# EAGLE design HC-05or06-Breakout (EAGLE 6.2)
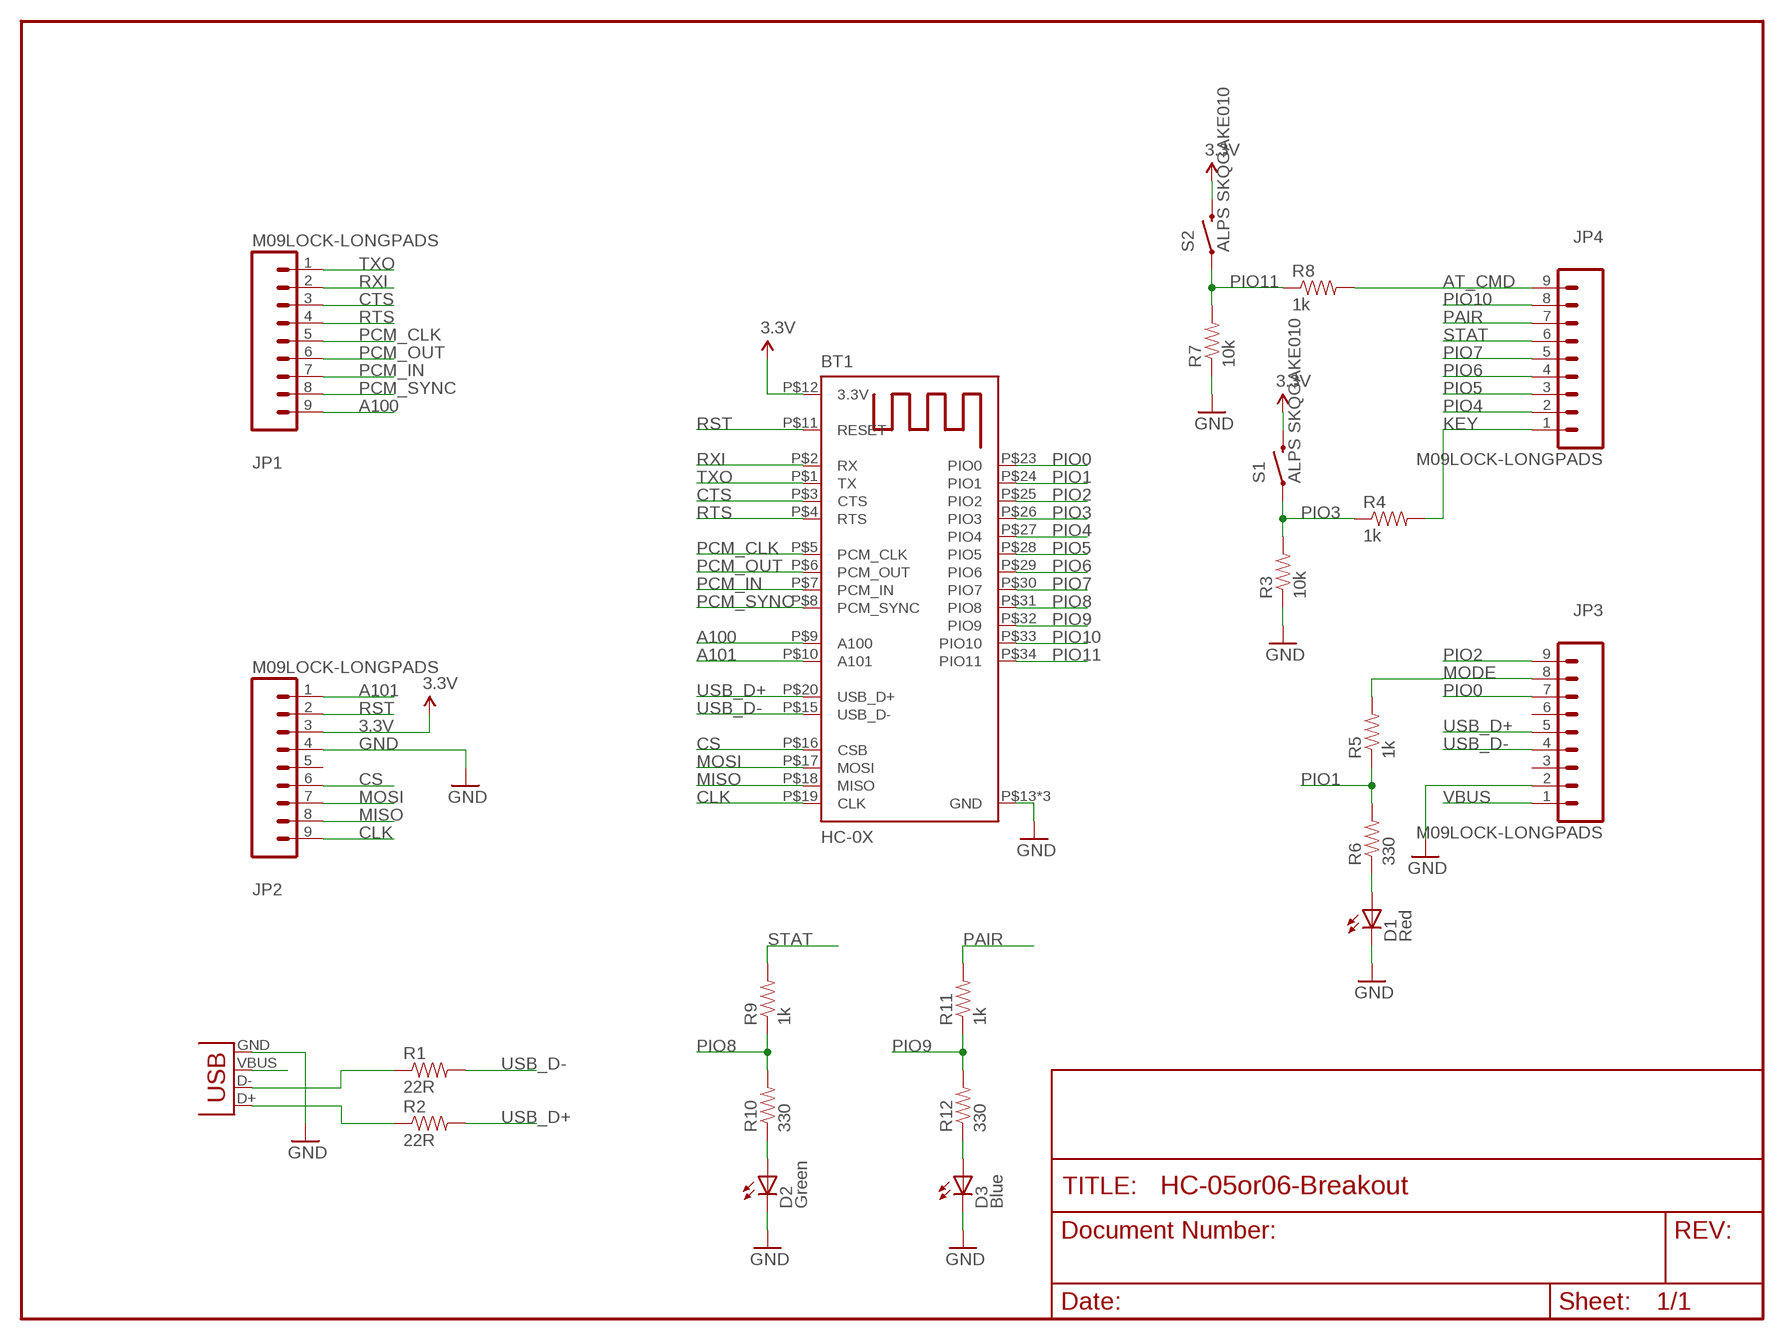
[diagram p0: schematic, sheet 1]

## Parts
BT1  HC-0X  [HC-0X]
D1  Red  LED0603  [LED-0603]
D2  Green  LED0603  [LED-0603]
D3  Blue  LED0603  [LED-0603]
JP1  M09LOCK-LONGPADS  [1X09_LOCK_LONGPADS]
JP2  M09LOCK-LONGPADS  [1X09_LOCK_LONGPADS]
JP3  M09LOCK-LONGPADS  [1X09_LOCK_LONGPADS]
JP4  M09LOCK-LONGPADS  [1X09_LOCK_LONGPADS]
R1  22R  RESISTOR0603-RES  [0603-RES]
R2  22R  RESISTOR0603-RES  [0603-RES]
R3  10k  RESISTOR0603-RES  [0603-RES]
R4  1k  RESISTOR0603-RES  [0603-RES]
R5  1k  RESISTOR0603-RES  [0603-RES]
R6  330  RESISTOR0603-RES  [0603-RES]
R7  10k  RESISTOR0603-RES  [0603-RES]
R8  1k  RESISTOR0603-RES  [0603-RES]
R9  1k  RESISTOR0603-RES  [0603-RES]
R10  330  RESISTOR0603-RES  [0603-RES]
R11  1k  RESISTOR0603-RES  [0603-RES]
R12  330  RESISTOR0603-RES  [0603-RES]
S1  ALPS SKQGAKE010  SWITCH-MOMENTARY-2SMD  [TACTILE_SWITCH_SMD]
S2  ALPS SKQGAKE010  SWITCH-MOMENTARY-2SMD  [TACTILE_SWITCH_SMD]
X1  USBSMD  [USB-MINIB]

## Nets
3.3V: BT1.P$12(3.3V) JP2.3 S1.3 S2.3
A100: BT1.P$9(A100) JP1.9
A101: BT1.P$10(A101) JP2.1
AT_CMD: JP4.9 R8.2
CLK: BT1.P$19(CLK) JP2.9
CS: BT1.P$16(CSB) JP2.6
CTS: BT1.P$3(CTS) JP1.3
GND: BT1.P$13(GND) BT1.P$21(GND) BT1.P$22(GND) D1.C D2.C D3.C JP2.4 JP3.2 R3.1 R7.1 X1.GND
KEY: JP4.1 R4.2
MISO: BT1.P$18(MISO) JP2.8
MODE: JP3.8 R5.2
MOSI: BT1.P$17(MOSI) JP2.7
N$1: D1.A R6.1
N$2: D2.A R10.1
N$4: D3.A R12.1
N$10: R1.1 X1.D-
N$11: R2.1 X1.D+
PAIR: JP4.7 R11.2
PCM_CLK: BT1.P$5(PCM_CLK) JP1.5
PCM_IN: BT1.P$7(PCM_IN) JP1.7
PCM_OUT: BT1.P$6(PCM_OUT) JP1.6
PCM_SYNC: BT1.P$8(PCM_SYNC) JP1.8
PIO0: BT1.P$23(PIO0) JP3.7
PIO1: BT1.P$24(PIO1) R5.1 R6.2
PIO2: BT1.P$25(PIO2) JP3.9
PIO3: BT1.P$26(PIO3) R3.2 R4.1 S1.1
PIO4: BT1.P$27(PIO4) JP4.2
PIO5: BT1.P$28(PIO5) JP4.3
PIO6: BT1.P$29(PIO6) JP4.4
PIO7: BT1.P$30(PIO7) JP4.5
PIO8: BT1.P$31(PIO8) R9.1 R10.2
PIO9: BT1.P$32(PIO9) R11.1 R12.2
PIO10: BT1.P$33(PIO10) JP4.8
PIO11: BT1.P$34(PIO11) R7.2 R8.1 S2.1
RST: BT1.P$11(RESET) JP2.2
RTS: BT1.P$4(RTS) JP1.4
RXI: BT1.P$2(RX) JP1.2
STAT: JP4.6 R9.2
TXO: BT1.P$1(TX) JP1.1
USB_D+: BT1.P$20(USB_D+) JP3.5 R2.2
USB_D-: BT1.P$15(USB_D-) JP3.4 R1.2
VBUS: JP3.1 X1.VBUS
Unconnected: JP2.5 JP3.3 JP3.6

## Library data of the parts
BT1 = Sterling-BlueTooth:HC-0X
D1-D3 = SparkFun-LED:LED: LEDs Standard schematic elements and footprints for 5mm, 3mm, 1206, and 0603 sized LEDs. 5mm - Spark Fun Electronics SKU : COM-00529 (and others)
JP1-JP4 = SparkFun-Connectors:M09: Header 9 Standard 9-pin 0.1" header. Use with straight break away headers (SKU : PRT-00116), right angle break away headers (PRT-00553), swiss pins (PRT-00743), machine pins (PRT-00117), and female headers (PRT-00115).
R1-R12 = SparkFun-Passives:RESISTOR: Resistor Basic schematic elements and footprints for 0603, 1206, and PTH resistors.
S1 S2 = SparkFun-Electromechanical:SWITCH-MOMENTARY-2: Various NO switches- pushbuttons, reed, etc
X1 = SparkFun-Connectors:USB: USB Connectors USB-B-PTH is fully proven SKU : PRT-00139 USB-miniB is fully proven SKU : PRT-00587 USB-A-PCB is untested. USB-A-H is throughly reviewed, but untested. Spark Fun Electronics SKU : PRT-00437 USB-B-SMT is throughly reviewed, but untested. Needs silkscreen touching up. USB-A-S has not been used/tested USB-MB-H has not been used/tested

## Net classes
0 default: width 0.305 mm, clearance 0.305 mm

## Board
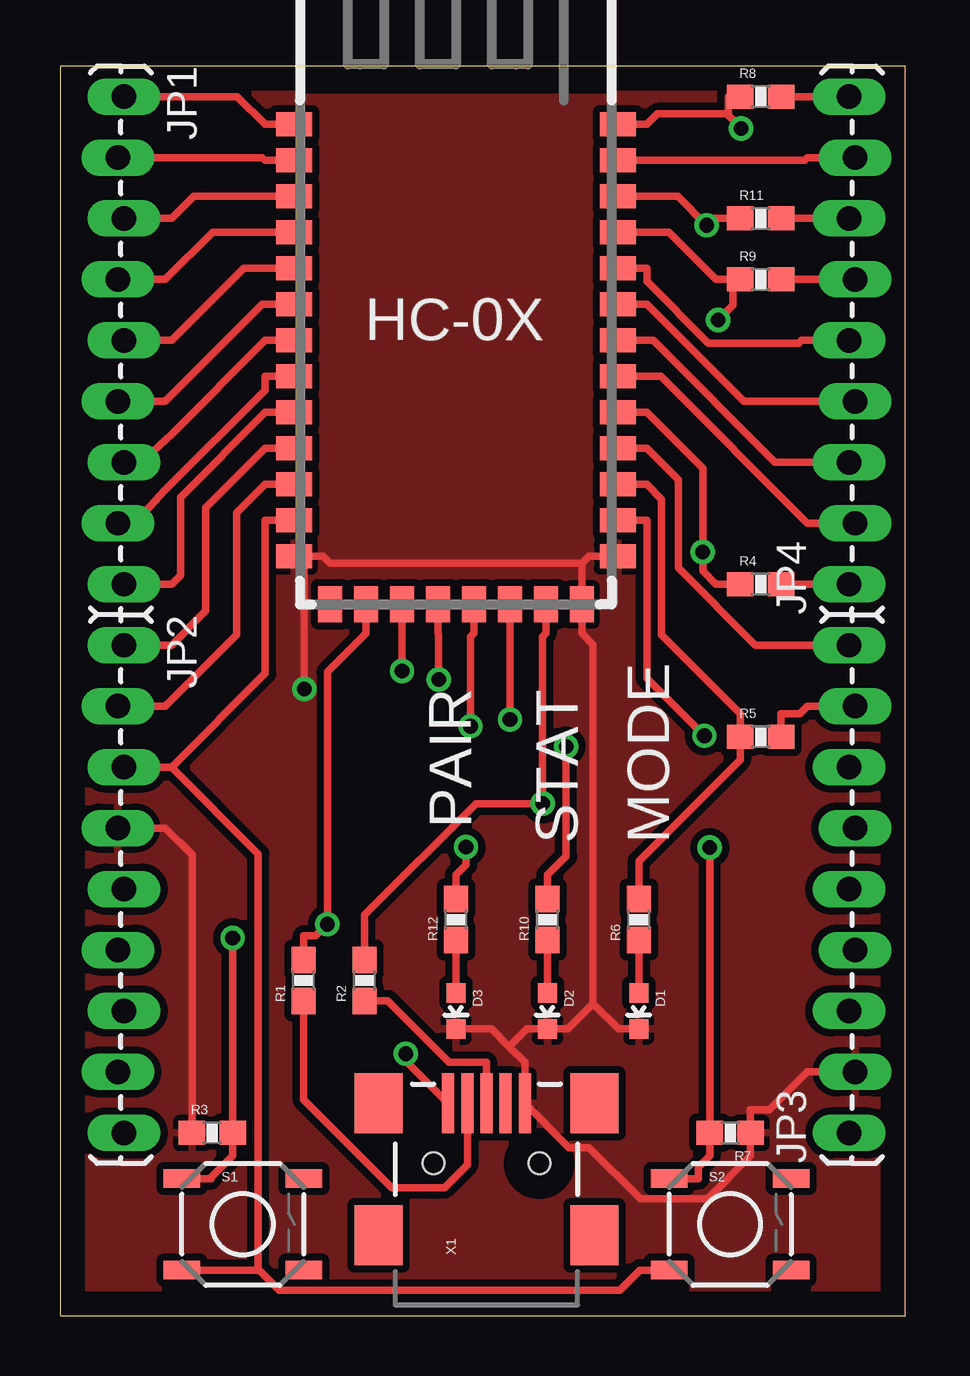
[diagram p1: board, top side]
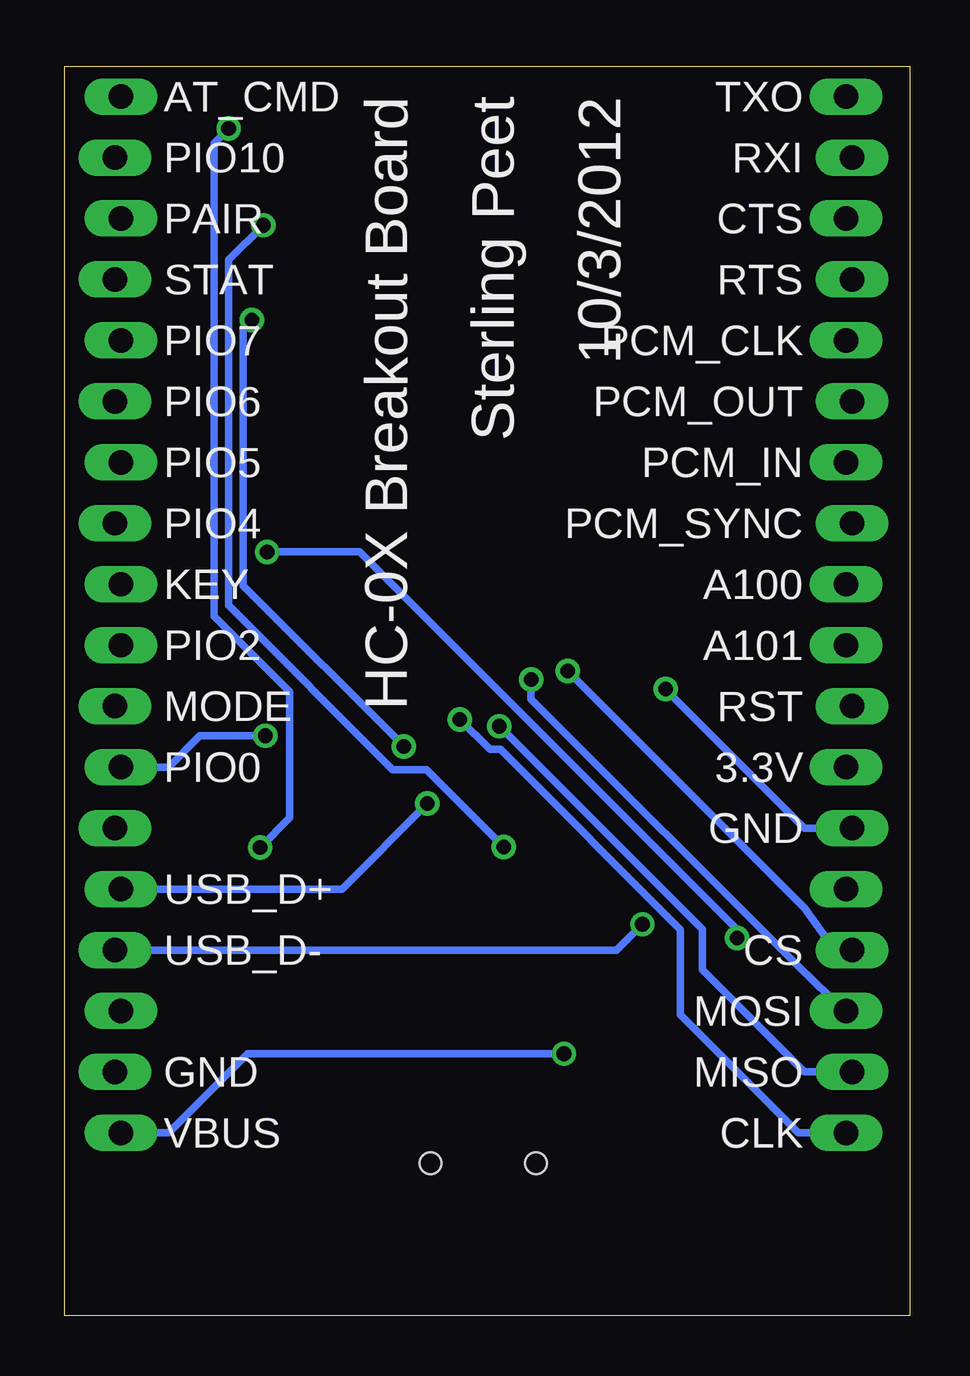
[diagram p2: board, bottom side, seen from below]

Size 35.23 x 52.06 mm. Coordinates in mm from the lower left corner, seen from the top.
Outline: 0,0 35.23,0 35.23,52.06 0,52.06 0,0
Copper layers (1*16): Top 0.035mm / dielectric 1.5mm / Bottom 0.035mm
Design rules "default": minimum track width 10mil, minimum drill 24mil, track to track 8mil, track to pad 8mil, pad to pad 8mil, via to via 8mil, smd to smd 8mil, copper to edge 40mil, drill to drill 8mil, minimum pad ring 10mil, minimum via ring 8mil, stop-mask expansion 4mil, vias tented up to drill 0mil, thermal gap 10mil
tKeepout: area 10.2,30.5 to 22.9,52.1

### Footprints (pad centres in the part's own frame; a part is rotated, then mirrored left to right if it is on the bottom)
HC-0X = smd 1.5 x 1: P$1 -6.75,9; P$2 -6.75,7.5; P$3 -6.75,6; P$4 -6.75,4.5; P$5 -6.75,3; P$6 -6.75,1.5; P$7 -6.75,0; P$8 -6.75,-1.5; P$9 -6.75,-3; P$10 -6.75,-4.5; P$11 -6.75,-6; P$12 -6.75,-7.5; P$13 -6.75,-9; P$22 6.75,-9; P$23 6.75,-7.5; P$24 6.75,-6; P$25 6.75,-4.5; P$26 6.75,-3; P$27 6.75,-1.5; P$28 6.75,0; P$29 6.75,1.5; P$30 6.75,3; P$31 6.75,4.5; P$32 6.75,6; P$33 6.75,7.5; P$34 6.75,9 | smd 1 x 1.5: P$14 -5.25,-11; P$15 -3.75,-11; P$16 -2.25,-11; P$17 -0.75,-11; P$18 0.75,-11; P$19 2.25,-11; P$20 3.75,-11; P$21 5.25,-11
LED-0603 = smd 0.8 x 0.8: A 0,-0.75; C 0,0.75
1X09_LOCK_LONGPADS = drill 1.016 long: 1 0,0.127; 2 2.54,-0.127; 3 5.08,0.127; 4 7.62,-0.127; 5 10.16,0.127; 6 12.7,-0.127; 7 15.24,0.127; 8 17.78,-0.127; 9 20.32,0.127
0603-RES = smd 1.1 x 1: 1 -0.85,0; 2 0.85,0
TACTILE_SWITCH_SMD = smd 1.524 x 0.762: 1 -2.54,1.905; 2 2.54,1.905; 3 -2.54,-1.905; 4 2.54,-1.905
USB-MINIB = smd 2.5 x 0.5: D+ 2.5,0; D- 2.5,0.8; GND 2.5,-1.6; ID 2.5,-0.8; VBUS 2.5,1.6 | smd 2.5 x 2: MTN1 -3,4.5; MTN2 2.5,4.5; MTN3 -3,-4.5; MTN4 2.5,-4.5 | hole 0.9: 0,2.2; 0,-2.2

### Placement (x,y rotation side)
BT1  16.51,40.64 0 top
D1  24.13,12.7 180 top
D2  20.32,12.7 180 top
D3  16.51,12.7 180 top
JP1  2.54,50.8 270 top
JP2  2.54,27.94 270 top
JP3  33.02,7.62 90 top
JP4  33.02,30.48 90 top
R1  10.16,13.97 90 top
R2  12.7,13.97 90 top
R3  6.35,7.62 0 top
R4  29.21,30.48 0 top
R5  29.21,24.13 0 top
R6  24.13,16.51 90 top
R7  27.94,7.62 180 top
R8  29.21,50.8 0 top
R9  29.21,43.18 0 top
R10  20.32,16.51 90 top
R11  29.21,45.72 0 top
R12  16.51,16.51 90 top
S1  7.62,3.81 0 top
S2  27.94,3.81 0 top
X1  17.78,6.35 90 top

### Tracks (layer width: path | path; a pad name or v marks a point on that pad's centre or on a via)
3.3V
  Top 0.305: 4.65,22.86 8.55,26.76 8.55,33.14 BT1.P$12 | 8.27,1.93 8.27,19.24 4.65,22.86 | JP2.3 4.65,22.86 | 8.27,1.93 9.13,1.07 23.34,1.07 24.18,1.91 S2.3 | 8.27,1.93 8.24,1.91 6.3,1.91 S1.3
A100
  Top 0.305: BT1.P$9 8.55,37.64 5.02,34.11 5.02,30.85 4.65,30.48 JP1.9
A101
  Top 0.305: JP2.1 4.65,27.94 6.08,29.37 6.08,33.67 8.55,36.14 BT1.P$10
AT_CMD
  Top 0.305: R8.2 JP4.9
CLK  (via drill 0.61 pad 1.02)
  Top 0.305: BT1.P$19 v18.76,24.84
  Bottom 0.305: v18.76,24.84 17.52,23.6 17.07,23.6 9.56,16.09 9.56,12.53 4.65,7.62 JP2.9
CS  (via drill 0.61 pad 1.02)
  Top 0.305: BT1.P$16 v14.26,26.87
  Bottom 0.305: v14.26,26.87 4.39,17 3.12,15.24 JP2.6
CTS
  Top 0.305: JP1.3 4.65,45.72 5.57,46.64 BT1.P$3
GND  (via drill 0.61 pad 1.02)
  Top 0.305: 10.18,31.64 v10.18,26.11 | JP2.4 4.39,20.32 5.5,19.21 R3.1 | 22.23,13 21.18,11.95 D2.C 19.46,11.95 18.73,11.21 | 22.23,13 22.23,27.97 21.76,28.43 BT1.P$21 21.76,31.35 | 22.23,13 23.27,11.95 D1.C | 10.18,31.64 10.97,31.64 11.26,31.35 21.76,31.35 | BT1.P$13 10.18,31.64 | JP3.2 31.17,10.16 29.58,8.58 28.79,8.58 R7.1 28.79,7.14 28.79,6.66 27,4.88 24.19,4.88 22.06,7.01 21.22,7.01 X1.GND 19.38,10.56 18.73,11.21 | 21.76,31.35 22.05,31.64 BT1.P$22 | D3.C 17.99,11.95 18.73,11.21
  Bottom 0.305: v10.18,26.11 4.39,20.32 JP2.4
  pour Top: 0,52.07 36.83,52.07 36.83,0 0,0
KEY
  Top 0.305: R4.2 JP4.1
MISO  (via drill 0.61 pad 1.02)
  Top 0.305: BT1.P$18 17.26,28.43 17.11,28.29 v17.11,24.56
  Bottom 0.305: JP2.8 4.39,10.16 8.65,14.41 8.65,16.09 v17.11,24.56
MODE
  Top 0.305: R5.2 30.06,25.09 30.85,25.09 31.17,25.4 JP3.8
MOSI  (via drill 0.61 pad 1.02)
  Top 0.305: BT1.P$17 15.76,28.43 15.79,28.4 v15.79,26.51
  Bottom 0.305: JP2.7 2.74,12.7 4.65,14.55 15.79,25.7 v15.79,26.51 | v15.79,26.51
N$1
  Top 0.305: R6.1 D1.A
N$2
  Top 0.305: R10.1 D2.A
N$4
  Top 0.305: R12.1 D3.A
N$10
  Top 0.305: X1.D- 16.98,6.29 16.03,5.34 13.82,5.34 10.16,9 R1.1
N$11
  Top 0.305: X1.D+ 17.78,10.56 16.22,10.56 13.66,13.12 R2.1
PAIR
  Top 0.305: R11.2 JP4.7
PCM_CLK
  Top 0.305: JP1.5 4.65,40.64 7.65,43.64 BT1.P$5
PCM_IN
  Top 0.305: BT1.P$7 8.55,40.64 4.65,36.74 3.38,35.56 JP1.7
PCM_OUT
  Top 0.305: JP1.6 4.39,38.1 8.43,42.14 BT1.P$6
PCM_SYNC
  Top 0.305: BT1.P$8 8.55,39.14 8.55,38.57 4.39,34.41 3.12,33.02 JP1.8
PIO0  (via drill 0.61 pad 1.02)
  Top 0.305: BT1.P$23 24.47,33.14 24.47,26.57 v26.87,24.17
  Bottom 0.305: JP3.7 30.91,22.86 29.6,24.17 v26.87,24.17
PIO1
  Top 0.305: R6.2 24.13,18.94 28.36,23.17 R5.1 28.36,25.09 25.08,28.37 25.08,34.03 24.47,34.64 BT1.P$24
PIO2
  Top 0.305: JP3.9 29,27.94 25.78,31.16 25.78,34.83 24.47,36.14 BT1.P$25
PIO3  (via drill 0.61 pad 1.02)
  Top 0.305: v7.2,15.74 R3.2 7.2,7.14 7.2,6.66 6.3,5.76 6.3,5.71 S1.1 | BT1.P$26 24.47,37.64 26.8,35.31 v26.8,31.83 26.8,31.04 27.35,30.48 R4.1
  Bottom 0.305: v26.8,31.83 22.95,31.83 7.2,16.08 v7.2,15.74
PIO4
  Top 0.305: BT1.P$27 25.05,39.14 31.17,33.02 JP4.2
PIO5
  Top 0.305: BT1.P$28 24.73,40.64 29.81,35.56 JP4.3
PIO6
  Top 0.305: BT1.P$29 24.47,42.14 28.51,38.1 JP4.4
PIO7
  Top 0.305: JP4.5 30.91,40.64 30.8,40.53 27.04,40.53 24.47,43.1 24.47,43.64 BT1.P$30
PIO8  (via drill 0.61 pad 1.02)
  Top 0.305: v21.1,23.72 21.1,19.14 20.32,18.37 R10.2 | 28.04,43.18 28.04,42.1 v27.43,41.49 | 28.04,43.18 27.35,43.18 25.39,45.14 BT1.P$31 | R9.1 28.04,43.18
  Bottom 0.305: v27.43,41.49 27.79,41.14 27.79,30.41 v21.1,23.72
PIO9  (via drill 0.61 pad 1.02)
  Top 0.305: v16.93,19.53 16.93,18.79 16.51,18.37 R12.2 | BT1.P$32 25.75,46.64 v26.95,45.44 27.23,45.72 27.35,45.72 R11.1
  Bottom 0.305: v26.95,45.44 28.4,43.99 28.4,29.6 21.56,22.76 20.16,22.76 v16.93,19.53
PIO10
  Top 0.305: JP4.8 31.17,48.26 31.05,48.14 24.47,48.14 BT1.P$33
PIO11  (via drill 0.61 pad 1.02)
  Top 0.305: S2.1 26.62,5.71 26.62,6.19 27.09,6.66 R7.2 v27.09,19.51 | v28.4,49.48 27.86,50.02 27.86,50.08 | 27.86,50.08 27.86,50.8 R8.1 | 27.86,50.08 24.91,50.08 24.47,49.64 BT1.P$34
  Bottom 0.305: v28.4,49.48 29.01,48.86 29.01,29.15 25.85,25.99 25.85,20.75 v27.09,19.51
RST
  Top 0.305: BT1.P$11 8.55,34.64 7.37,33.46 7.37,28.38 4.39,25.4 JP2.2
RTS
  Top 0.305: JP1.4 4.39,43.18 6.35,45.14 BT1.P$4
RXI
  Top 0.305: BT1.P$2 8.55,48.14 8.43,48.26 JP1.2
STAT
  Top 0.305: R9.2 JP4.6
TXO
  Top 0.305: BT1.P$1 8.55,49.64 7.39,50.8 JP1.1
USB_D+  (via drill 0.61 pad 1.02)
  Top 0.305: BT1.P$20 20.26,28.43 20.12,28.3 v20.12,21.34 17.34,21.34 12.7,16.7 R2.2
  Bottom 0.305: JP3.5 23.68,17.78 v20.12,21.34
USB_D-  (via drill 0.61 pad 1.02)
  Top 0.305: BT1.P$15 12.76,28.43 11.15,26.83 v11.15,16.31 10.67,15.83 10.16,15.83 R1.2
  Bottom 0.305: JP3.4 31.17,15.24 12.23,15.24 v11.15,16.31
VBUS  (via drill 0.61 pad 1.02)
  Top 0.305: X1.VBUS 14.42,10.61 v14.42,10.92
  Bottom 0.305: v14.42,10.92 27.61,10.92 30.91,7.62 JP3.1

### Text on the board
tPlace: HC-0X | PAIR | STAT | MODE
bPlace: TXO | 10/3/2012 | Sterling Peet | HC-0X Breakout Board | AT_CMD | RXI | PIO10 | CTS | PAIR | RTS | STAT | PCM_CLK | PIO7 | PCM_OUT | PIO6 | PCM_IN | PIO5 | PCM_SYNC | PIO4 | A100 | KEY | A101 | PIO2 | RST | MODE | 3.3V | PIO0 | GND | USB_D+ | CS | USB_D- | MOSI | MISO | GND | CLK | VBUS